# EAGLE schematic HW4_SCHEMATIC (EAGLE 9.6.2)
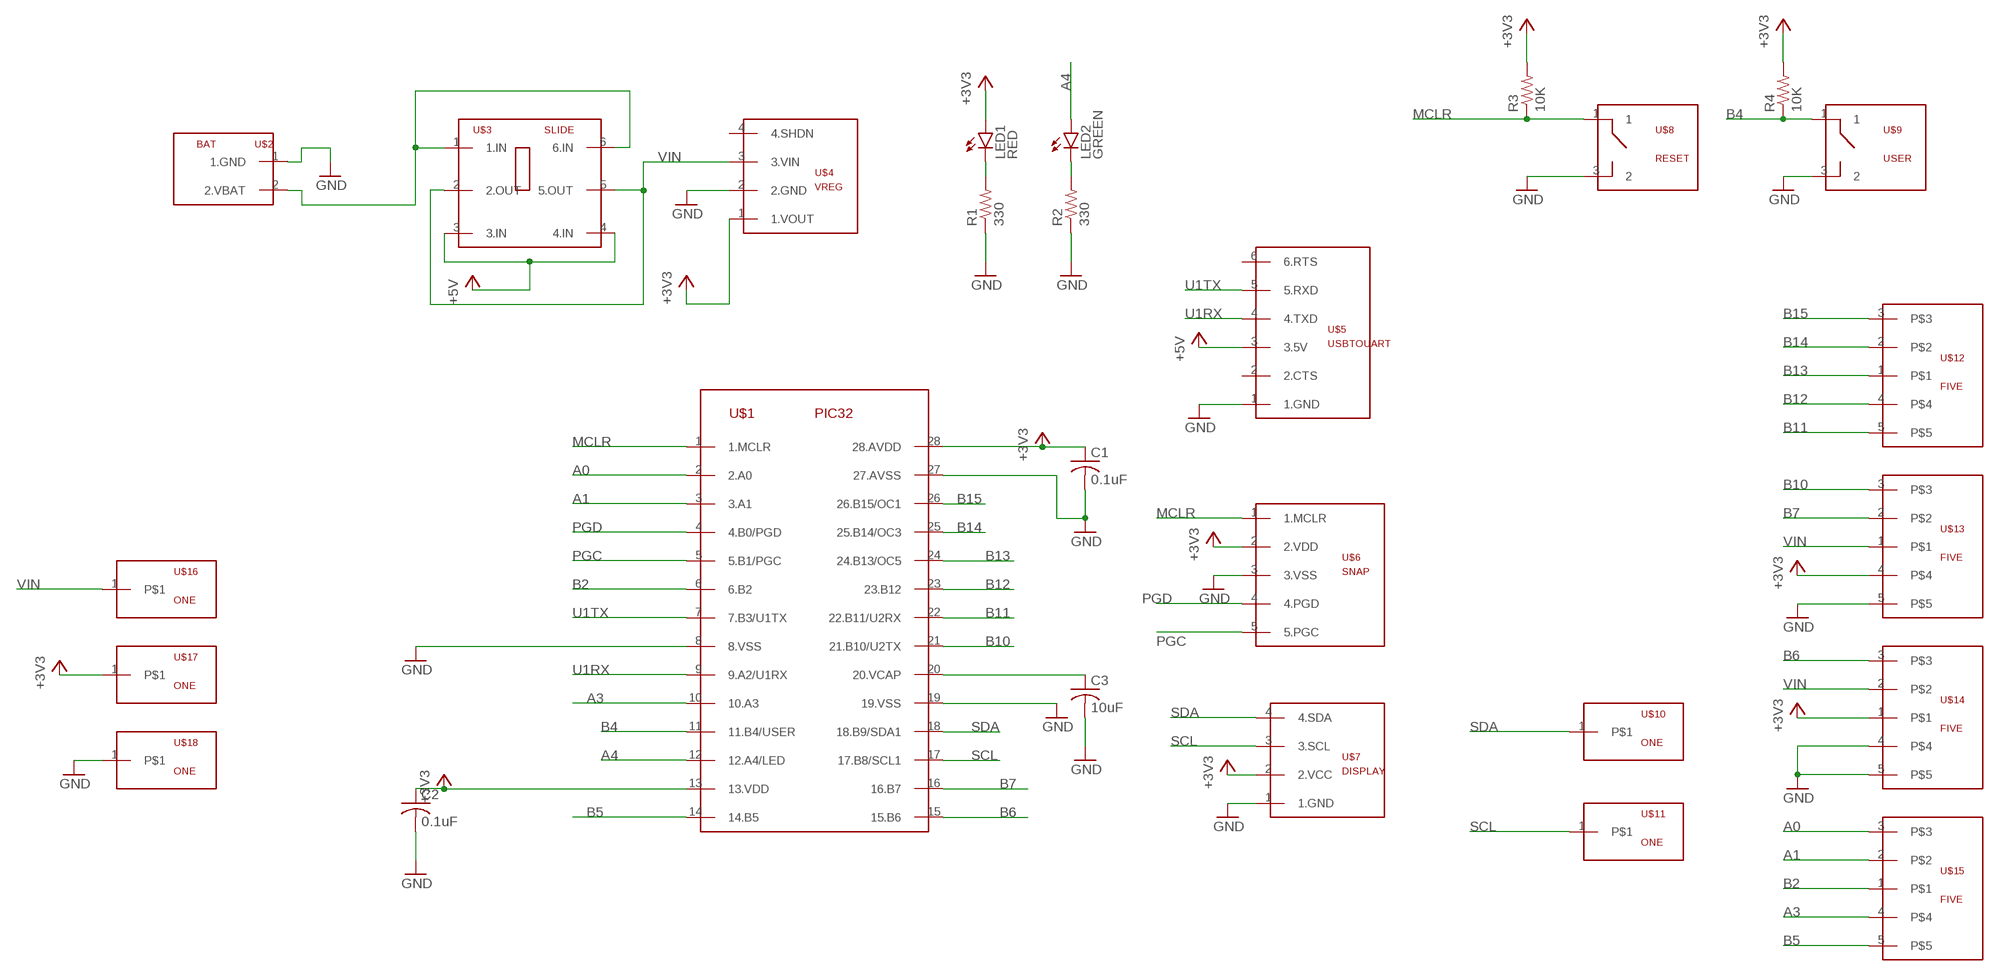
[diagram p0: schematic, sheet 1]

## Parts
C1  0.1uF  C-US025-024X044  [C025-024X044]
C2  0.1uF  C-US025-024X044  [C025-024X044]
C3  10uF  C-US025-024X044  [C025-024X044]
LED1  RED  LED3MM  [LED3MM]
LED2  GREEN  LED3MM  [LED3MM]
R1  330  R-US_0207/7  [0207/7]
R2  330  R-US_0207/7  [0207/7]
R3  10K  R-US_0207/7  [0207/7]
R4  10K  R-US_0207/7  [0207/7]
U$1  PIC32  [DIL28-3]
U$2  BAT  [BAT]
U$3  SLIDE  [SLIDE]
U$4  VREG  [VREG]
U$5  USBTOUART  [USBTOUART]
U$6  SNAP  [SNAP]
U$7  DISPLAY  [DISPLAY]
U$8  RESET  BUTTON  [BUTTON]
U$9  USER  BUTTON  [BUTTON]
U$10  ONE  [ONE]
U$11  ONE  [ONE]
U$12  FIVE  [FIVE]
U$13  FIVE  [FIVE]
U$14  FIVE  [FIVE]
U$15  FIVE  [FIVE]
U$16  ONE  [ONE]
U$17  ONE  [ONE]
U$18  ONE  [ONE]

## Nets
+3V3: C1.1 C2.1 LED1.A R3.2 R4.2 U$1.13(13.VDD) U$1.28(28.AVDD) U$4.1(1.VOUT) U$6.2(2.VDD) U$7.2(2.VCC) U$13.4 U$14.1 U$17.1
+5V: U$3.3(3.IN) U$3.4(4.IN) U$5.3(3.5V)
A0: U$1.2(2.A0) U$15.3
A1: U$1.3(3.A1) U$15.2
A3: U$1.10(10.A3) U$15.4
A4: LED2.A U$1.12(12.A4/LED)
B2: U$1.6(6.B2) U$15.1
B4: R4.1 U$1.11(11.B4/USER) U$9.1
B5: U$1.14(14.B5) U$15.5
B6: U$1.15(15.B6) U$14.3
B7: U$1.16(16.B7) U$13.2
B10: U$1.21(21.B10/U2TX) U$13.3
B11: U$1.22(22.B11/U2RX) U$12.5
B12: U$1.23(23.B12) U$12.4
B13: U$1.24(24.B13/OC5) U$12.1
B14: U$1.25(25.B14/OC3) U$12.2
B15: U$1.26(26.B15/OC1) U$12.3
GND: C1.2 C2.2 C3.2 R1.1 R2.1 U$1.8(8.VSS) U$1.19(19.VSS) U$1.27(27.AVSS) U$2.1(1.GND) U$4.2(2.GND) U$5.1(1.GND) U$6.3(3.VSS) U$7.1(1.GND) U$8.3 U$9.3 U$13.5 U$14.4 U$14.5 U$18.1
MCLR: R3.1 U$1.1(1.MCLR) U$6.1(1.MCLR) U$8.1
N$2: U$2.2(2.VBAT) U$3.1(1.IN) U$3.6(6.IN)
N$4: LED2.K(C) R2.2
N$5: LED1.K(C) R1.2
N$6: C3.1 U$1.20(20.VCAP)
PGC: U$1.5(5.B1/PGC) U$6.5(5.PGC)
PGD: U$1.4(4.B0/PGD) U$6.4(4.PGD)
SCL: U$1.17(17.B8/SCL1) U$7.3(3.SCL) U$11.1
SDA: U$1.18(18.B9/SDA1) U$7.4(4.SDA) U$10.1
U1RX: U$1.9(9.A2/U1RX) U$5.4(4.TXD)
U1TX: U$1.7(7.B3/U1TX) U$5.5(5.RXD)
VIN: U$3.2(2.OUT) U$3.5(5.OUT) U$4.3(3.VIN) U$13.1 U$14.2 U$16.1
Unconnected: U$4.4(4.SHDN) U$5.2(2.CTS) U$5.6(6.RTS)

## Library data of the parts
C1-C3 = HW4_LIBRARY:C-US: CAPACITOR, American symbol; SPICEPREFIX: C
LED1 LED2 = HW4_LIBRARY:LED: LED OSRAM: - CHIPLED LG R971, LG N971, LY N971, LG Q971, LY Q971, LO R971, LY R971 LH N974, LH R974 LS Q976, LO Q976, LY Q976 LO Q996 - Hyper CHIPLED LW Q18S LB Q993, LB Q99A, LB R99A - SideLED LS A670, LO A670, LY A670, LG A670, LP A670 LB A673, LV A673, LT A673, LW A673 LH A674 LY A675 LS A676, LA A676, LO A676, LY A676, LW A676 LS A679, LY A679, LG A679 - Hyper Micro SIDELED® LS Y876, LA Y876, LO Y876, LY Y876 LT Y87S - SmartLED LW L88C, LW L88S LB L89C, LB L89S, LG L890 LS L89K, LO L89K, LY L89K LS L896, LA L896, LO L896, LY L896 - TOPLED LS T670, LO T670, LY T670, LG T670, LP T670 LSG T670, LSP T670, LSY T670, LOP T670, LYG T670 LG T671, LOG T671, LSG T671 LB T673, LV T673, LT T673, LW T673 LH T674 LS T676, LA T676, LO T676, LY T676, LB T676, LH T676, LSB T676, LW T676 LB T67C, LV T67C, LT T67C, LS T67K, LO T67K, LY T67K, LW E67C LS E67B, LA E67B, LO E67B, LY E67B, LB E67C, LV E67C, LT E67C LW T67C LS T679, LY T679, LG T679 LS T770, LO T770, LY T770, LG T770, LP T770 LB T773, LV T773, LT T773, LW T773 LH T774 LS E675, LA E675, LY E675, LS T675 LS T776, LA T776, LO T776, LY T776, LB T776 LHGB T686 LT T68C, LB T68C - Hyper Mini TOPLED® LB M676 - Mini TOPLED Santana® LG M470 LS M47K, LO M47K, LY M47K Source: http://www.osram.convergy.de LUXEON: - LUMILED® LXK2-PW12-R00, LXK2-PW12-S00, LXK2-PW14-U00, LXK2-PW14-V00 LXK2-PM12-R00, LXK2-PM12-S00, LXK2-PM14-U00 LXK2-PE12-Q00, LXK2-PE12-R00, LXK2-PE12-S00, LXK2-PE14-T00, LXK2-PE14-U00 LXK2-PB12-K00, LXK2-PB12-L00, LXK2-PB12-M00, LXK2-PB14-N00, LXK2-PB14-P00, LXK2-PB14-Q00 LXK2-PR12-L00, LXK2-PR12-M00, LXK2-PR14-Q00, LXK2-PR14-R00 LXK2-PD12-Q00, LXK2-PD12-R00, LXK2-PD12-S00 LXK2-PH12-R00, LXK2-PH12-S00 LXK2-PL12-P00, LXK2-PL12-Q00, LXK2-PL12-R00 Source: www.luxeon.com KINGBRIGHT: KA-3528ASYC Source: www.kingbright.com
R1-R4 = HW4_LIBRARY:R-US_: RESISTOR, American symbol; SPICEPREFIX: R
U$1 = HW4_LIBRARY:PIC32
U$2 = HW4_LIBRARY:BAT
U$3 = HW4_LIBRARY:SLIDE
U$4 = HW4_LIBRARY:VREG
U$5 = HW4_LIBRARY:USBTOUART
U$6 = HW4_LIBRARY:SNAP
U$7 = HW4_LIBRARY:DISPLAY
U$8 U$9 = HW4_LIBRARY:BUTTON
U$10 U$11 U$16-U$18 = HW4_LIBRARY:ONE
U$12-U$15 = HW4_LIBRARY:FIVE